# EAGLE schematic LED_Matrix (EAGLE 6.2)
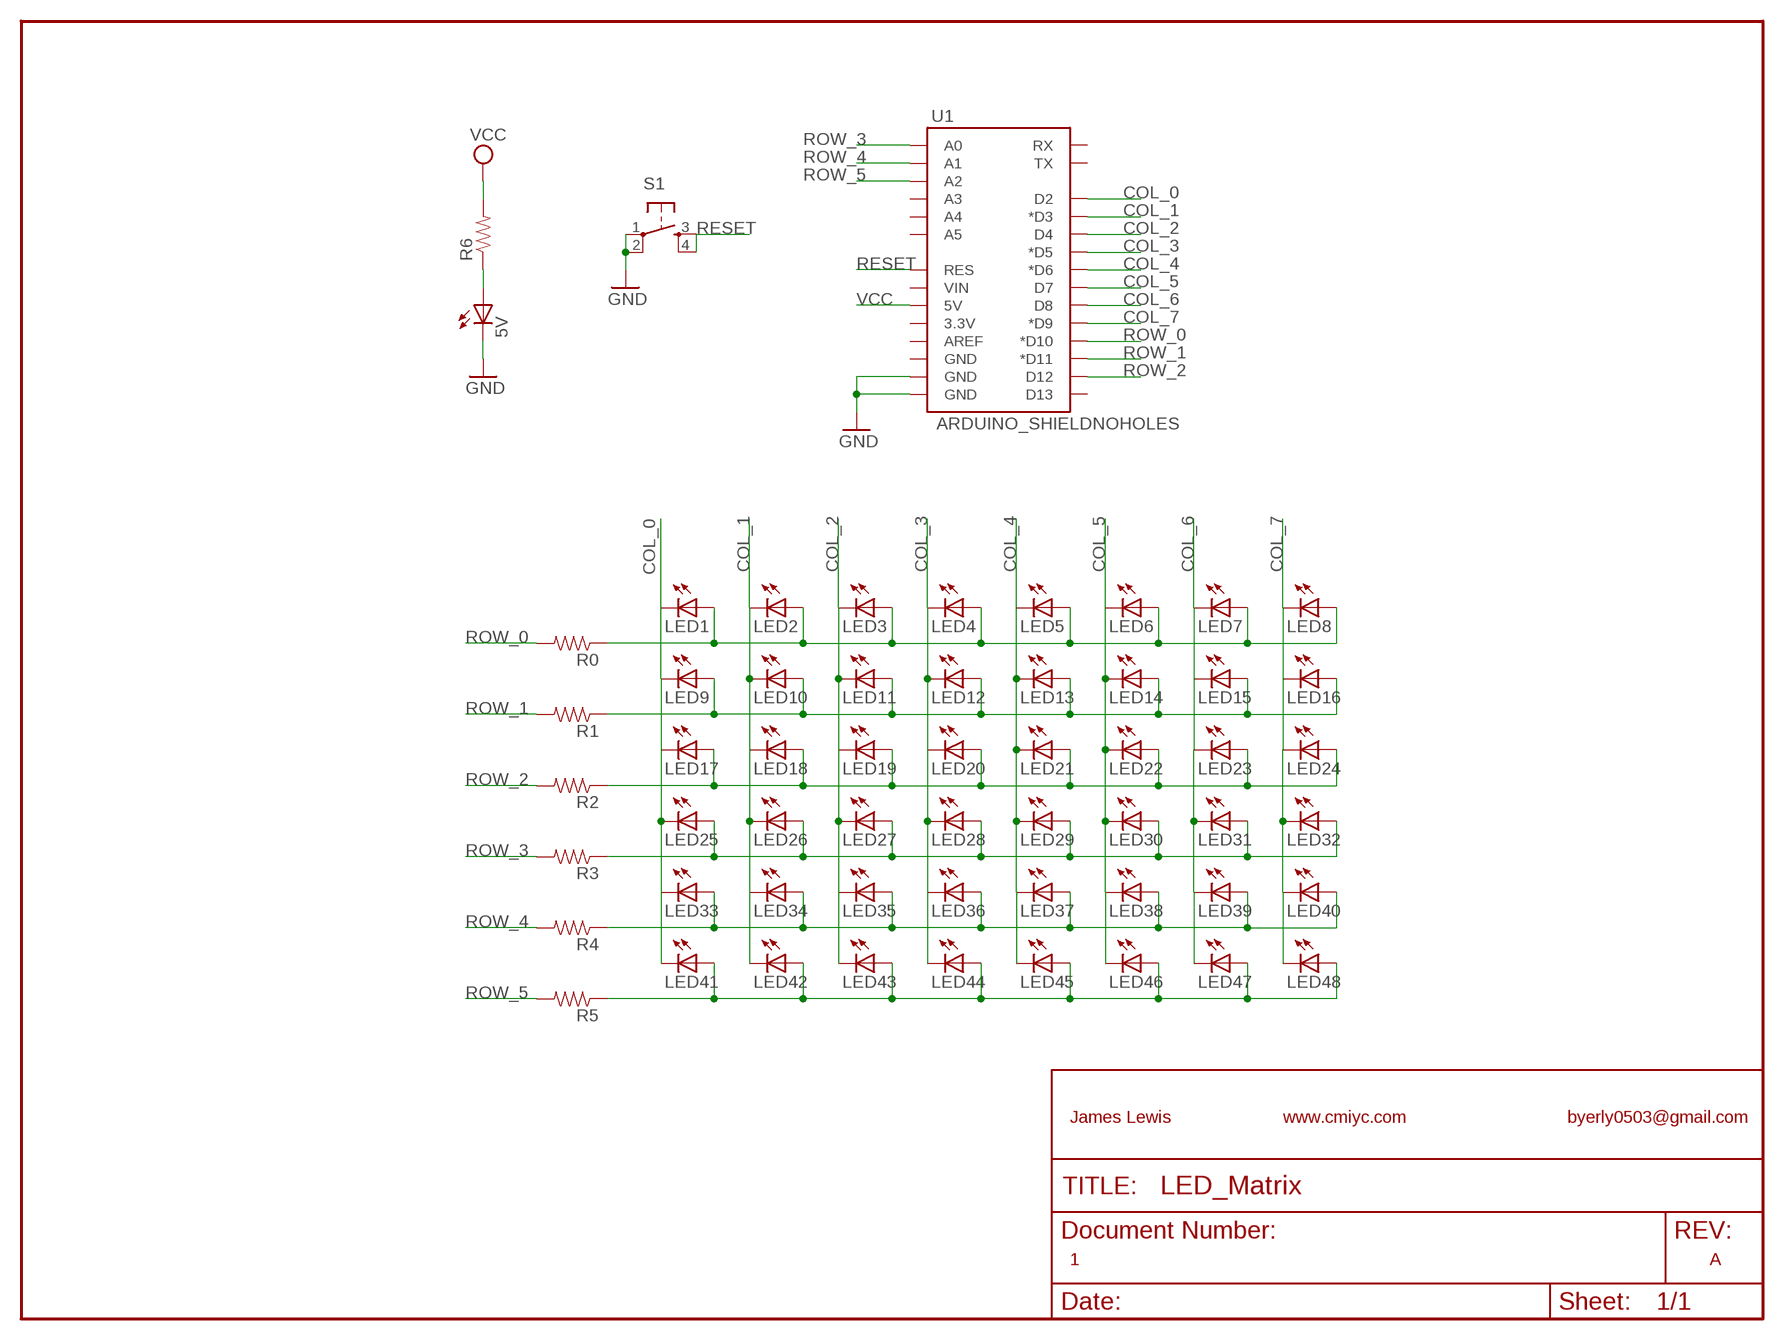
[diagram p0: schematic, sheet 1]

## Parts
5V  LED1206  [LED-1206]
LED1  LED5MM  [LED5MM]
LED2  LED5MM  [LED5MM]
LED3  LED5MM  [LED5MM]
LED4  LED5MM  [LED5MM]
LED5  LED5MM  [LED5MM]
LED6  LED5MM  [LED5MM]
LED7  LED5MM  [LED5MM]
LED8  LED5MM  [LED5MM]
LED9  LED5MM  [LED5MM]
LED10  LED5MM  [LED5MM]
LED11  LED5MM  [LED5MM]
LED12  LED5MM  [LED5MM]
LED13  LED5MM  [LED5MM]
LED14  LED5MM  [LED5MM]
LED15  LED5MM  [LED5MM]
LED16  LED5MM  [LED5MM]
LED17  LED5MM  [LED5MM]
LED18  LED5MM  [LED5MM]
LED19  LED5MM  [LED5MM]
LED20  LED5MM  [LED5MM]
LED21  LED5MM  [LED5MM]
LED22  LED5MM  [LED5MM]
LED23  LED5MM  [LED5MM]
LED24  LED5MM  [LED5MM]
LED25  LED5MM  [LED5MM]
LED26  LED5MM  [LED5MM]
LED27  LED5MM  [LED5MM]
LED28  LED5MM  [LED5MM]
LED29  LED5MM  [LED5MM]
LED30  LED5MM  [LED5MM]
LED31  LED5MM  [LED5MM]
LED32  LED5MM  [LED5MM]
LED33  LED5MM  [LED5MM]
LED34  LED5MM  [LED5MM]
LED35  LED5MM  [LED5MM]
LED36  LED5MM  [LED5MM]
LED37  LED5MM  [LED5MM]
LED38  LED5MM  [LED5MM]
LED39  LED5MM  [LED5MM]
LED40  LED5MM  [LED5MM]
LED41  LED5MM  [LED5MM]
LED42  LED5MM  [LED5MM]
LED43  LED5MM  [LED5MM]
LED44  LED5MM  [LED5MM]
LED45  LED5MM  [LED5MM]
LED46  LED5MM  [LED5MM]
LED47  LED5MM  [LED5MM]
LED48  LED5MM  [LED5MM]
R0  RESISTOR1206  [1206]
R1  RESISTOR1206  [1206]
R2  RESISTOR1206  [1206]
R3  RESISTOR1206  [1206]
R4  RESISTOR1206  [1206]
R5  RESISTOR1206  [1206]
R6  RESISTOR1206  [1206]
S1  TAC_SWITCHSMD  [TACTILE_SWITCH_SMD]
U1  ARDUINO_SHIELDNOHOLES  [DUEMILANOVE_SHIELD_NOHOLES]

## Nets
COL_0: LED1.K(C) LED9.K(C) LED17.K(C) LED25.K(C) LED33.K(C) LED41.K(C) U1.D2
COL_1: LED2.K(C) LED10.K(C) LED18.K(C) LED26.K(C) LED34.K(C) LED42.K(C) U1.D3(*D3)
COL_2: LED3.K(C) LED11.K(C) LED19.K(C) LED27.K(C) LED35.K(C) LED43.K(C) U1.D4
COL_3: LED4.K(C) LED12.K(C) LED20.K(C) LED28.K(C) LED36.K(C) LED44.K(C) U1.D5(*D5)
COL_4: LED5.K(C) LED13.K(C) LED21.K(C) LED29.K(C) LED37.K(C) LED45.K(C) U1.D6(*D6)
COL_5: LED6.K(C) LED14.K(C) LED22.K(C) LED30.K(C) LED38.K(C) LED46.K(C) U1.D7
COL_6: LED7.K(C) LED15.K(C) LED23.K(C) LED31.K(C) LED39.K(C) LED47.K(C) U1.D8
COL_7: LED8.K(C) LED16.K(C) LED24.K(C) LED32.K(C) LED40.K(C) LED48.K(C) U1.D9(*D9)
GND: 5V.C S1.1 S1.2 U1.GND@0(GND) U1.GND@1(GND)
N$1: LED41.A LED42.A LED43.A LED44.A LED45.A LED46.A LED47.A LED48.A R5.1
N$3: 5V.A R6.1
OLD_1: LED1.A LED2.A LED3.A LED4.A LED5.A LED6.A LED7.A LED8.A R0.1
OLD_2: LED9.A LED10.A LED11.A LED12.A LED13.A LED14.A LED15.A LED16.A R1.1
OLD_3: LED17.A LED18.A LED19.A LED20.A LED21.A LED22.A LED23.A LED24.A R2.1
OLD_4: LED25.A LED26.A LED27.A LED28.A LED29.A LED30.A LED31.A LED32.A R3.1
OLD_5: LED33.A LED34.A LED35.A LED36.A LED37.A LED38.A LED39.A LED40.A R4.1
RESET: S1.3 S1.4 U1.RES
ROW_0: R0.2 U1.D10(*D10)
ROW_1: R1.2 U1.D11(*D11)
ROW_2: R2.2 U1.D12
ROW_3: R3.2 U1.A0
ROW_4: R4.2 U1.A1
ROW_5: R5.2 U1.A2
VCC: R6.2 U1.5V
Unconnected: U1.3.3V U1.A3 U1.A4 U1.A5 U1.AREF U1.D13 U1.GND@2(GND) U1.RX U1.TX U1.VIN

## Notes on the sheet
- James Lewis | www.cmiyc.com | byerly0503@gmail.com
- 1 | A

## Library data of the parts
5V LED1-LED48 = SparkFun:LED: LEDs Standard schematic elements and footprints for 5mm, 3mm, 1206, and 0603 sized LEDs. 5mm - Spark Fun Electronics SKU : COM-00529 (and others)
R0 R1-R6 = SparkFun:RESISTOR: Resistor Basic schematic elements and footprints for 0603, 1206, and PTH 1/10th watt (small) resistors.
S1 = SparkFun:TAC_SWITCH: Momentary Switch Button commonly used for reset or general input. Spark Fun Electronics SKU : COM-00097
U1 = SparkFun2:ARDUINO_SHIELD